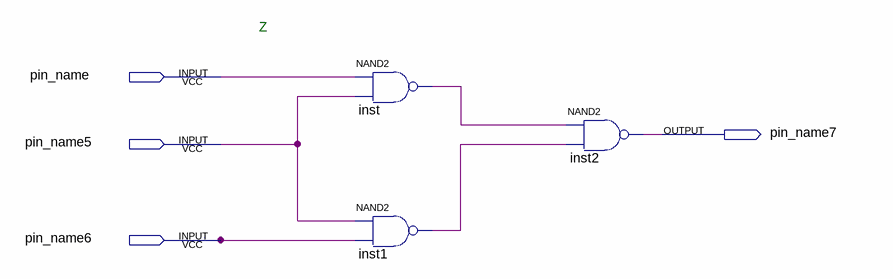
[diagram p0: schematic sheet]
// Quartus schematic lab4.bdf as structural Verilog: 3 symbols, 4 pins
module lab4 (
  input  pin_name,
  input  pin_name5,
  input  pin_name6,
  output pin_name7
);

  wire inst1_out, inst_out;

  nand inst (inst_out, pin_name, pin_name5);
  nand inst1 (inst1_out, pin_name5, pin_name6);
  nand inst2 (pin_name7, inst_out, inst1_out);

  // Notes on the sheet:
  //   Z
endmodule
